# Altium schematic sheet Nixies-digits-control.SchDoc: =ProjectTitle
size 297 x 209 mm; Address1: Address1; Address2: Address2; Address3: Address3; Address4: Address4; SheetNumber: ?; SheetTotal: ?; Scale: 1:1; DocumentType: Схема электрическая принципиальная; Title2str: ?
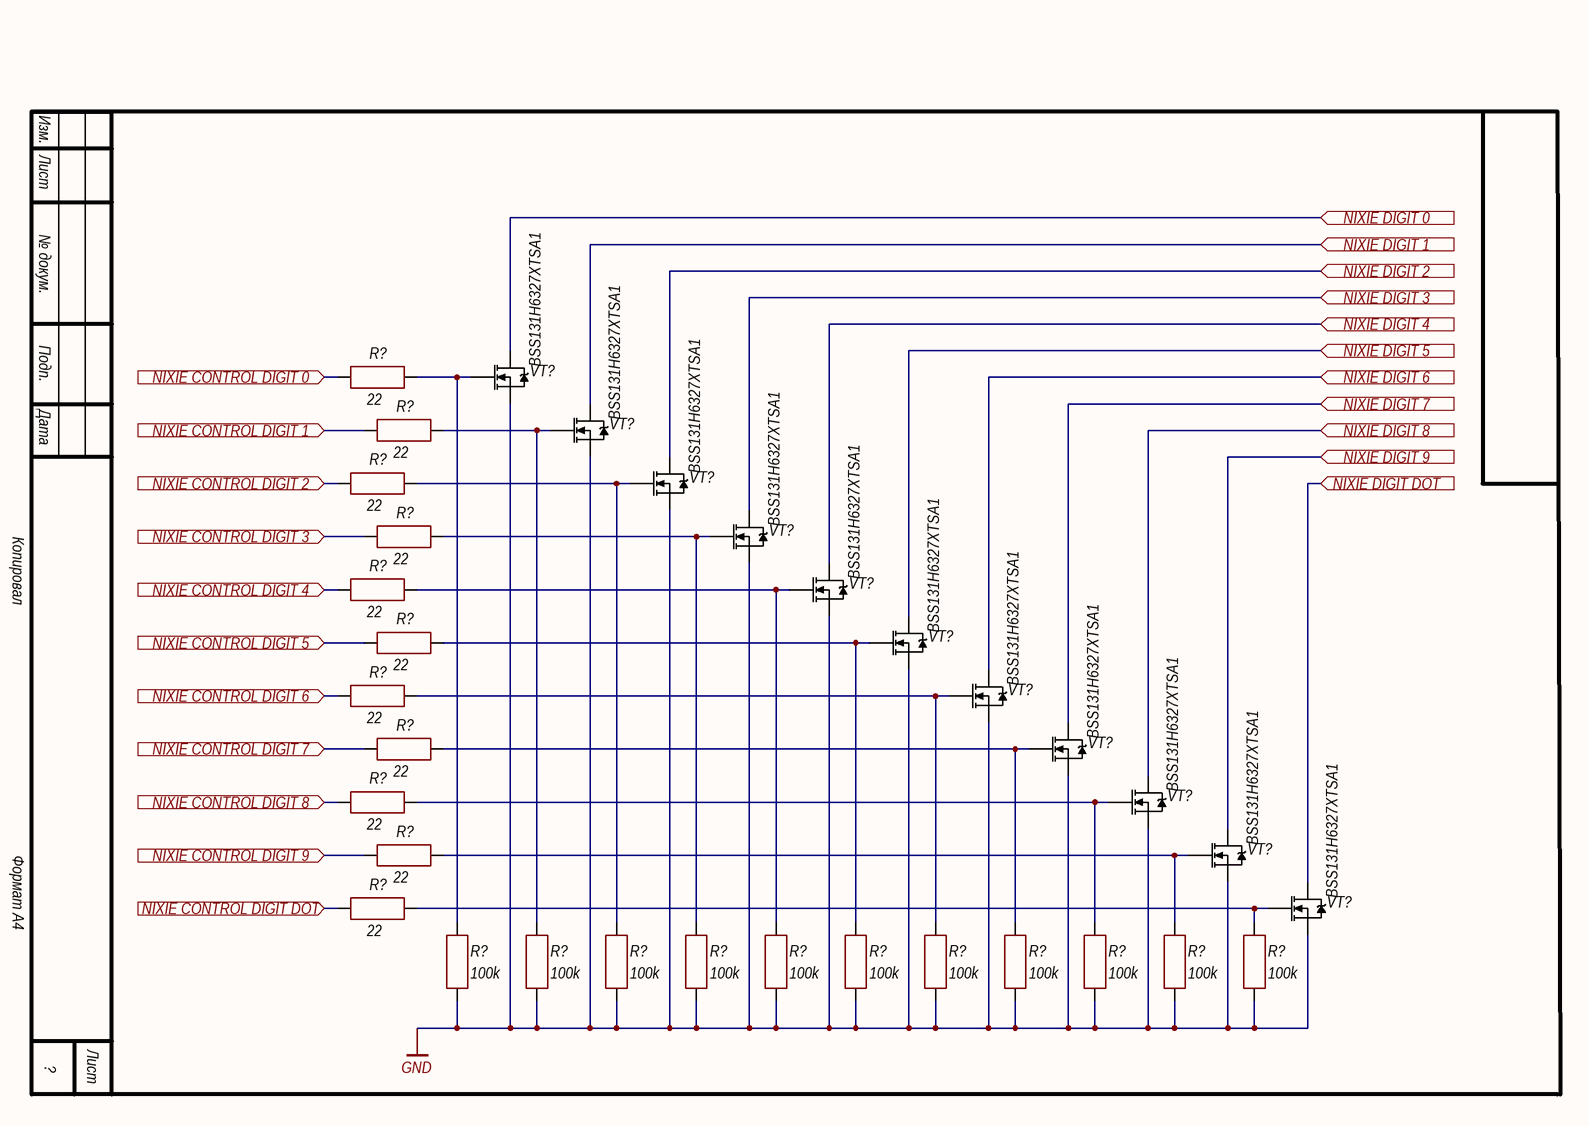
[diagram p0: Nixies-digits-control.SchDoc]

## Parts
(Parts that share a designator on the sheet are numbered #1, #2 ... from top to bottom, then left to right.)
R?#1  22  [CH0402R]
R?#2  22  [CH0402R]
R?#3  22  [CH0402R]
R?#4  22  [CH0402R]
R?#5  22  [CH0402R]
R?#6  22  [CH0402R]
R?#7  22  [CH0402R]
R?#8  22  [CH0402R]
R?#9  22  [CH0402R]
R?#10  22  [CH0402R]
R?#11  22  [CH0402R]
R?#12  100k  [CH0402R]
R?#13  100k  [CH0402R]
R?#14  100k  [CH0402R]
R?#15  100k  [CH0402R]
R?#16  100k  [CH0402R]
R?#17  100k  [CH0402R]
R?#18  100k  [CH0402R]
R?#19  100k  [CH0402R]
R?#20  100k  [CH0402R]
R?#21  100k  [CH0402R]
R?#22  100k  [CH0402R]
VT?#1  BSS131H6327XTSA1  [SOT23_123]
VT?#2  BSS131H6327XTSA1  [SOT23_123]
VT?#3  BSS131H6327XTSA1  [SOT23_123]
VT?#4  BSS131H6327XTSA1  [SOT23_123]
VT?#5  BSS131H6327XTSA1  [SOT23_123]
VT?#6  BSS131H6327XTSA1  [SOT23_123]
VT?#7  BSS131H6327XTSA1  [SOT23_123]
VT?#8  BSS131H6327XTSA1  [SOT23_123]
VT?#9  BSS131H6327XTSA1  [SOT23_123]
VT?#10  BSS131H6327XTSA1  [SOT23_123]
VT?#11  BSS131H6327XTSA1  [SOT23_123]

## Ports
NIXIE CONTROL DIGIT 0 (in), NIXIE CONTROL DIGIT 1 (in), NIXIE CONTROL DIGIT 2 (in), NIXIE CONTROL DIGIT 3 (in), NIXIE CONTROL DIGIT 4 (in), NIXIE CONTROL DIGIT 5 (in), NIXIE CONTROL DIGIT 6 (in), NIXIE CONTROL DIGIT 7 (in), NIXIE CONTROL DIGIT 8 (in), NIXIE CONTROL DIGIT 9 (in), NIXIE CONTROL DIGIT DOT (in), NIXIE DIGIT 0 (in), NIXIE DIGIT 1 (in), NIXIE DIGIT 2 (in), NIXIE DIGIT 3 (in), NIXIE DIGIT 4 (in), NIXIE DIGIT 5 (in), NIXIE DIGIT 6 (in), NIXIE DIGIT 7 (in), NIXIE DIGIT 8 (in), NIXIE DIGIT 9 (in), NIXIE DIGIT DOT (in)

## Nets
GND: R?#12.1 R?#13.1 R?#14.1 R?#15.1 R?#16.1 R?#17.1 R?#18.1 R?#19.1 R?#20.1 R?#21.1 R?#22.1 VT?#1.3(S) VT?#2.3(S) VT?#3.3(S) VT?#4.3(S) VT?#5.3(S) VT?#6.3(S) VT?#7.3(S) VT?#8.3(S) VT?#9.3(S) VT?#10.3(S) VT?#11.3(S)
NIXIE CONTROL DIGIT 0: R?#1.1 ; port NIXIE CONTROL DIGIT 0
NIXIE CONTROL DIGIT 1: R?#2.1 ; port NIXIE CONTROL DIGIT 1
NIXIE CONTROL DIGIT 2: R?#3.1 ; port NIXIE CONTROL DIGIT 2
NIXIE CONTROL DIGIT 3: R?#4.1 ; port NIXIE CONTROL DIGIT 3
NIXIE CONTROL DIGIT 4: R?#5.1 ; port NIXIE CONTROL DIGIT 4
NIXIE CONTROL DIGIT 5: R?#6.1 ; port NIXIE CONTROL DIGIT 5
NIXIE CONTROL DIGIT 6: R?#7.1 ; port NIXIE CONTROL DIGIT 6
NIXIE CONTROL DIGIT 7: R?#8.1 ; port NIXIE CONTROL DIGIT 7
NIXIE CONTROL DIGIT 8: R?#9.1 ; port NIXIE CONTROL DIGIT 8
NIXIE CONTROL DIGIT 9: R?#10.1 ; port NIXIE CONTROL DIGIT 9
NIXIE CONTROL DIGIT DOT: R?#11.1 ; port NIXIE CONTROL DIGIT DOT
NIXIE DIGIT 0: VT?#1.2(D) ; port NIXIE DIGIT 0
NIXIE DIGIT 1: VT?#2.2(D) ; port NIXIE DIGIT 1
NIXIE DIGIT 2: VT?#3.2(D) ; port NIXIE DIGIT 2
NIXIE DIGIT 3: VT?#4.2(D) ; port NIXIE DIGIT 3
NIXIE DIGIT 4: VT?#5.2(D) ; port NIXIE DIGIT 4
NIXIE DIGIT 5: VT?#6.2(D) ; port NIXIE DIGIT 5
NIXIE DIGIT 6: VT?#7.2(D) ; port NIXIE DIGIT 6
NIXIE DIGIT 7: VT?#8.2(D) ; port NIXIE DIGIT 7
NIXIE DIGIT 8: VT?#9.2(D) ; port NIXIE DIGIT 8
NIXIE DIGIT 9: VT?#10.2(D) ; port NIXIE DIGIT 9
NIXIE DIGIT DOT: VT?#11.2(D) ; port NIXIE DIGIT DOT
NetR?#1_2: R?#1.2 R?#12.2 VT?#1.1(G)
NetR?#2_2: R?#2.2 R?#13.2 VT?#2.1(G)
NetR?#3_2: R?#3.2 R?#14.2 VT?#3.1(G)
NetR?#4_2: R?#4.2 R?#15.2 VT?#4.1(G)
NetR?#5_2: R?#5.2 R?#16.2 VT?#5.1(G)
NetR?#6_2: R?#6.2 R?#17.2 VT?#6.1(G)
NetR?#7_2: R?#7.2 R?#18.2 VT?#7.1(G)
NetR?#8_2: R?#8.2 R?#19.2 VT?#8.1(G)
NetR?#9_2: R?#9.2 R?#20.2 VT?#9.1(G)
NetR?#10_2: R?#10.2 R?#21.2 VT?#10.1(G)
NetR?#11_2: R?#11.2 R?#22.2 VT?#11.1(G)

## Notes on the sheet
- Изм.
- Лист
- № докум.
- Подп.
- Дата
- Копировал
- Формат А4

## Library data of the parts
R?#1-R?#22 = Resistor: Manufacturer: *; Model: *; HelpURL: *; ComponentKind: *
  R?#1-R?#11: Value: 22
  R?#12-R?#22: Value: 100k
VT?#1-VT?#11 = N-chanel: Mosfet; Manufacturer: Infineon Technologies Ag; Model: BSS131H6327XTSA1; ComponentKind: 240V. 1.8V, 100mA; HelpURL: https://www.terraelectronica.ru/product/1112834